# EAGLE design master_hub_board (EAGLE 5.11)
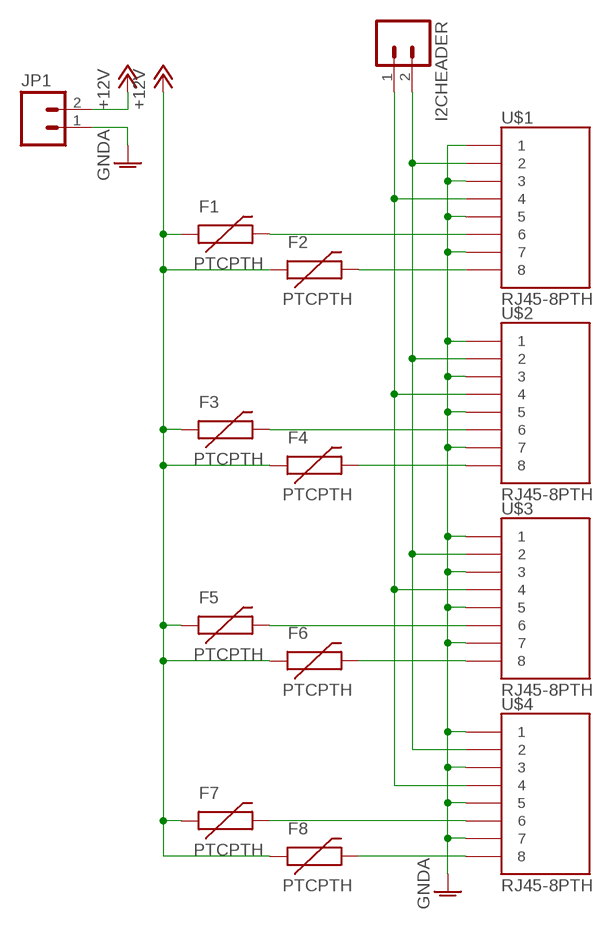
[diagram p0: schematic, sheet 1]

## Parts
F1  PTCPTH  [PTC]
F2  PTCPTH  [PTC]
F3  PTCPTH  [PTC]
F4  PTCPTH  [PTC]
F5  PTCPTH  [PTC]
F6  PTCPTH  [PTC]
F7  PTCPTH  [PTC]
F8  PTCPTH  [PTC]
I2CHEADER  M02LOCK  [1X02_LOCK]
JP1  M02PTH4  [1X02_XTRA_BIG]
U$1  RJ45-8PTH  [RJ45-8]
U$2  RJ45-8PTH  [RJ45-8]
U$3  RJ45-8PTH  [RJ45-8]
U$4  RJ45-8PTH  [RJ45-8]

## Nets
+12V: F1.P$1 F2.P$1 F3.P$1 F4.P$1 F5.P$1 F6.P$1 F7.P$1 F8.P$1 JP1.2
GNDA: JP1.1 U$1.1 U$1.3 U$1.5 U$1.7 U$2.1 U$2.3 U$2.5 U$2.7 U$3.1 U$3.3 U$3.5 U$3.7 U$4.1 U$4.3 U$4.5 U$4.7
N$1: F1.P$2 U$1.6
N$2: F2.P$2 U$1.8
N$3: F3.P$2 U$2.6
N$4: F4.P$2 U$2.8
N$5: F5.P$2 U$3.6
N$6: F6.P$2 U$3.8
N$7: F7.P$2 U$4.6
N$8: F8.P$2 U$4.8
N$9: I2CHEADER.2 U$1.2 U$2.2 U$3.2 U$4.2
N$10: I2CHEADER.1 U$1.4 U$2.4 U$3.4 U$4.4

## Library data of the parts
F1-F8 = SparkFun:PTC: Resettable Fuse PTC Resettable Fuse. Spark Fun Electronics SKU : COM-08357
I2CHEADER JP1 = SparkFun:M02: Header 2 Standard 2-pin 0.1" header. Use with straight break away headers (SKU : PRT-00116), right angle break away headers (PRT-00553), swiss pins (PRT-00743), machine pins (PRT-00117), and female headers (PRT-00115). Molex polarized connector foot print use with SKU : PRT-08233 with associated crimp pins and housings.
U$1-U$4 = SparkFun:RJ45-8: RJ45 Jack Simple RJ45, 8-pin connection - connector for common Cat5, Cat5e, and Cat6 Ethernet cables. Footprint not yet proven in production. Connector sku is PRT-00643; Breakout PCB sku is BOB-00716.

## Board
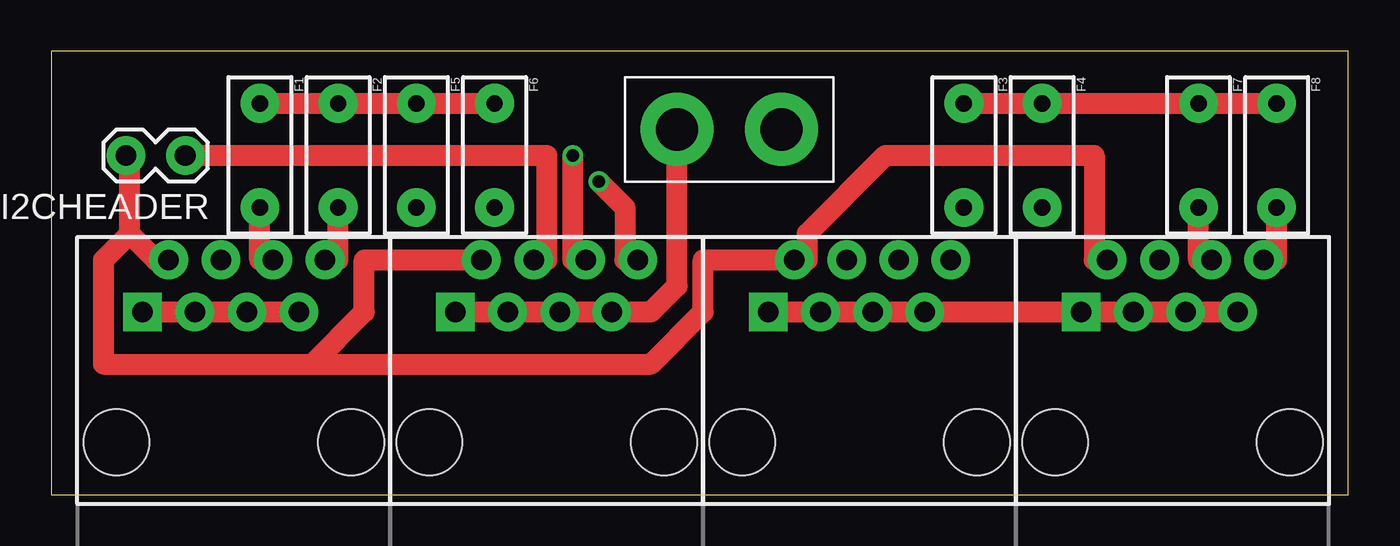
[diagram p1: board, top side]
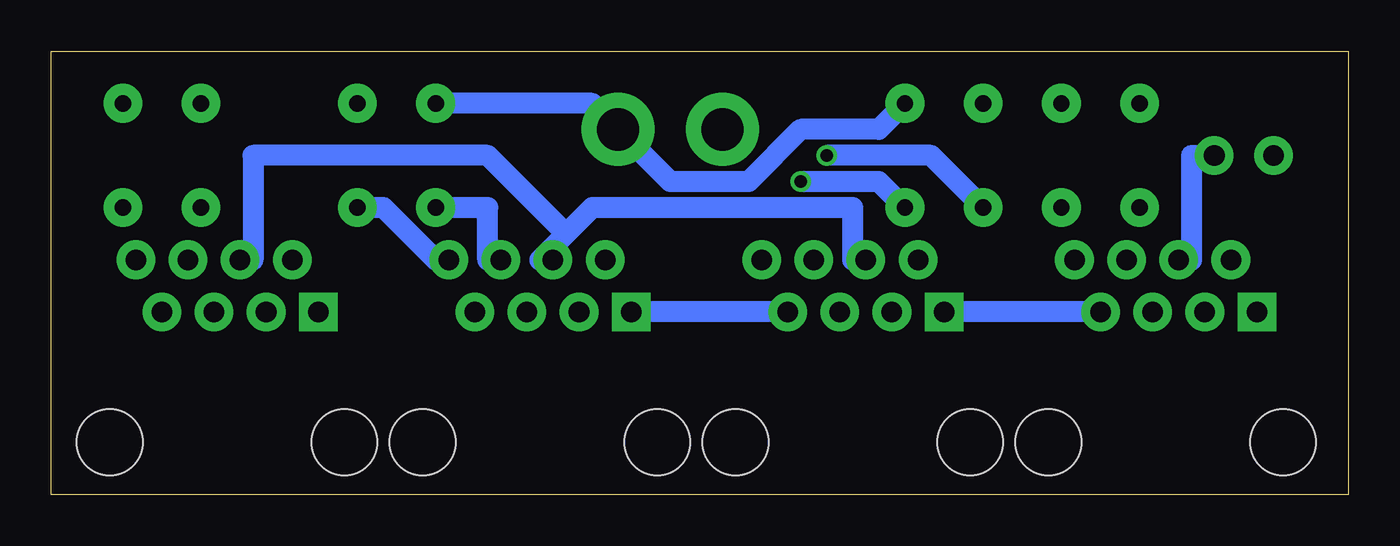
[diagram p2: board, bottom side, seen from below]

Size 63.17 x 21.58 mm. Coordinates in mm from the lower left corner, seen from the top.
Outline: 0,0 63.17,0 63.17,21.58 0,21.58 0,0
Copper layers (1*16): Top 0.035mm / dielectric 1.5mm / Bottom 0.035mm
Design rules "default *": minimum track width 40mil, minimum drill 24mil, track to track 8mil, track to pad 8mil, pad to pad 8mil, via to via 8mil, smd to smd 8mil, copper to edge 40mil, drill to drill 8mil, minimum pad ring 10mil, minimum via ring 8mil, stop-mask expansion 4mil, vias tented up to drill 0mil, thermal gap 10mil

### Footprints (pad centres in the part's own frame; a part is rotated, then mirrored left to right if it is on the bottom)
PTC = drill 0.8 pad 1.88 round: P$1 -2.54,0; P$2 2.54,0
1X02_LOCK = drill 1.016 pad 1.88 round: 1 -0.178,0; 2 2.718,0
1X02_XTRA_BIG = drill 2.057 pad 3.556 round: 1 -2.54,0; 2 2.54,0
RJ45-8 = drill 1 pad 1.88 square: 1 -4.445,6.35 | drill 1 pad 1.88 round: 2 -3.175,8.89; 3 -1.905,6.35; 4 -0.635,8.89; 5 0.635,6.35; 6 1.905,8.89; 7 3.175,6.35; 8 4.445,8.89 | hole 3.2: -5.715,0; 5.715,0

### Placement (x,y rotation side)
F1  10.16,16.51 270 top
F2  13.97,16.51 270 top
F3  44.45,16.51 270 top
F4  48.26,16.51 270 top
F5  17.78,16.51 270 top
F6  21.59,16.51 270 top
F7  55.88,16.51 270 top
F8  59.69,16.51 270 top
I2CHEADER  6.35,16.51 180 top
JP1  33.02,17.78 0 top
U$1  8.89,2.54 0 top
U$2  39.37,2.54 0 top
U$3  24.13,2.54 0 top
U$4  54.61,2.54 0 top

### Tracks (layer width: path | path; a pad name or v marks a point on that pad's centre or on a via)
+12V
  Top 1.016: F1.P$1 F2.P$1 F5.P$1 F6.P$1 | F3.P$1 F4.P$1 F7.P$1 F8.P$1
  Bottom 1.016: F3.P$1 36.83,19.05 JP1.2 33.02,15.24 29.21,15.24 26.67,17.78 22.86,17.78 F6.P$1
GNDA
  Top 1.016: U$4.7 U$4.5 U$4.3 U$4.1 U$2.7 U$2.5 U$2.3 U$2.1 | U$1.1 U$1.3 U$1.5 U$1.7 | U$3.1 U$3.3 U$3.5 U$3.7 29.21,8.89 30.48,10.16 JP1.1
  Bottom 1.016: U$1.7 U$3.1 | U$3.7 U$2.1
N$1
  Top 1.016: F1.P$2 10.16,11.43 U$1.6
N$2
  Top 1.016: F2.P$2 13.97,11.43 U$1.8
N$3
  Bottom 1.016: F3.P$2 41.91,13.97 41.91,11.43 U$2.6
N$4
  Bottom 1.016: F4.P$2 46.99,13.97 44.45,11.43 U$2.8
N$5  (via drill 0.61)
  Top 1.016: v25.4,16.51 25.4,11.43 U$3.6
  Bottom 1.016: F5.P$2 20.32,16.51 v25.4,16.51
N$6  (via drill 0.61)
  Top 1.016: v26.67,15.24 27.94,13.97 27.94,11.43 U$3.8
  Bottom 1.016: F6.P$2 22.86,15.24 v26.67,15.24
N$7
  Top 1.016: F7.P$2 55.88,11.43 U$4.6
N$8
  Top 1.016: F8.P$2 59.69,11.43 U$4.8
N$9
  Top 1.016: U$4.2 50.8,11.43 50.8,16.51 40.64,16.51 36.83,12.7 36.83,11.43 U$2.2 31.75,11.43 31.75,8.89 29.21,6.35 12.7,6.35 | 3.81,12.7 5.08,11.43 U$1.2 | 3.81,12.7 3.81,16.51 I2CHEADER.2 | 12.7,6.35 15.24,8.89 15.24,11.43 U$3.2 | 12.7,6.35 2.54,6.35 2.54,11.43 3.81,12.7
N$10
  Top 1.016: 6.35,16.51 I2CHEADER.1 24.13,16.51 24.13,11.43 U$3.4
  Bottom 1.016: U$1.4 7.62,11.43 7.62,16.51 I2CHEADER.1 6.35,16.51 | 38.1,12.7 39.37,11.43 U$2.4 | 38.1,12.7 36.83,13.97 24.13,13.97 24.13,11.43 U$3.4 | 38.1,12.7 41.91,16.51 53.34,16.51 53.34,11.43 U$4.4